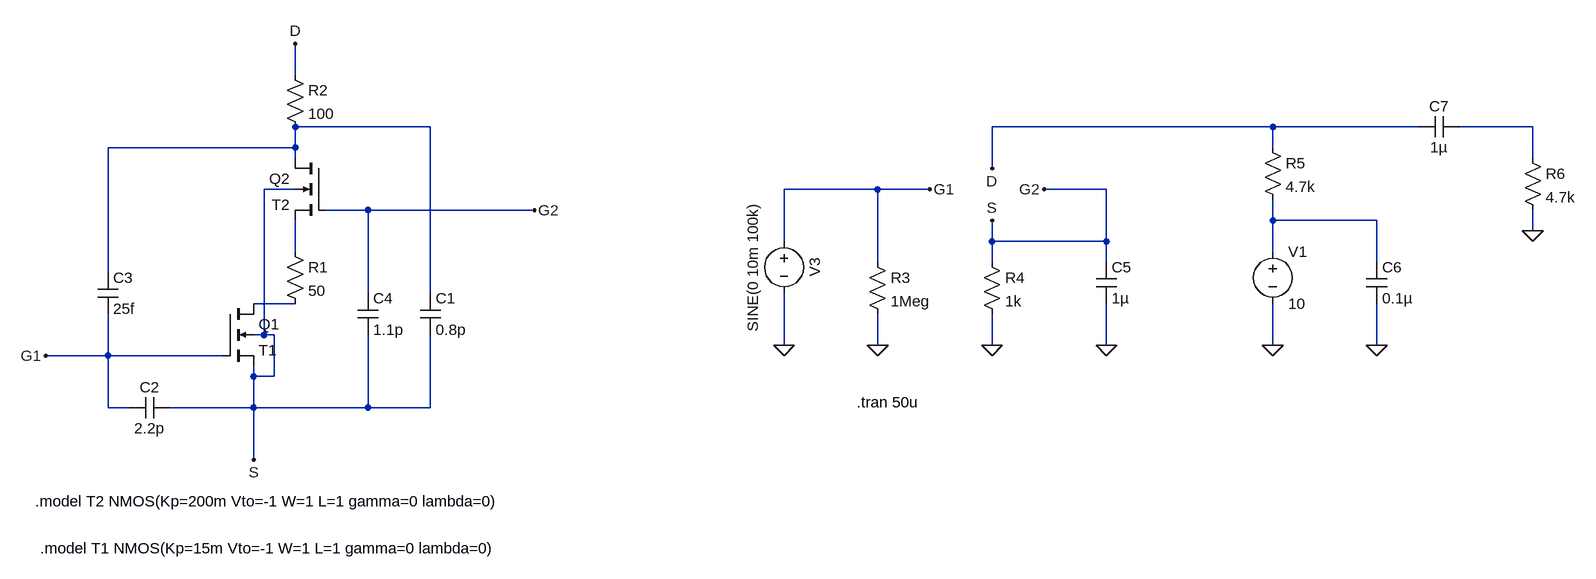
[diagram p0: schematic Ganancia_AV_Macromodelo.asc]
Ganancia_AV_Macromodelo.asc, the LTspice schematic file:
Version 4
SHEET 1 2140 680
WIRE 144 -256 144 -304
WIRE 352 -176 144 -176
WIRE 1648 -176 1216 -176
WIRE 1872 -176 1648 -176
WIRE 2048 -176 1936 -176
WIRE 144 -144 144 -176
WIRE 144 -144 -144 -144
WIRE 1648 -144 1648 -176
WIRE 144 -128 144 -144
WIRE 2048 -128 2048 -176
WIRE 1216 -112 1216 -176
WIRE 144 -80 96 -80
WIRE 1040 -80 896 -80
WIRE 1120 -80 1040 -80
WIRE 1392 -80 1296 -80
WIRE 256 -48 192 -48
WIRE 512 -48 256 -48
WIRE 1648 -32 1648 -64
WIRE 1808 -32 1648 -32
WIRE 2048 -16 2048 -48
WIRE 896 0 896 -80
WIRE 1216 0 1216 -32
WIRE 1392 0 1392 -80
WIRE 1392 0 1216 0
WIRE 144 16 144 -32
WIRE 1648 16 1648 -32
WIRE 1040 32 1040 -80
WIRE 1216 32 1216 0
WIRE 1392 32 1392 0
WIRE 1808 32 1808 -32
WIRE -144 48 -144 -144
WIRE 256 80 256 -48
WIRE 352 80 352 -176
WIRE 144 96 80 96
WIRE 96 144 96 -80
WIRE 96 144 80 144
WIRE 112 144 96 144
WIRE 896 160 896 80
WIRE 1040 160 1040 112
WIRE 1216 160 1216 112
WIRE 1392 160 1392 96
WIRE 1648 160 1648 96
WIRE 1808 160 1808 96
WIRE -144 176 -144 112
WIRE -144 176 -240 176
WIRE 32 176 -144 176
WIRE 80 208 80 192
WIRE 112 208 112 144
WIRE 112 208 80 208
WIRE -144 256 -144 176
WIRE -112 256 -144 256
WIRE 80 256 80 208
WIRE 80 256 -48 256
WIRE 256 256 256 144
WIRE 256 256 80 256
WIRE 352 256 352 144
WIRE 352 256 256 256
WIRE 80 336 80 256
FLAG 144 -304 D
FLAG -240 176 G1
FLAG 512 -48 G2
FLAG 80 336 S
FLAG 1040 160 0
FLAG 1216 160 0
FLAG 1392 160 0
FLAG 1216 -32 S
FLAG 1120 -80 G1
FLAG 1296 -80 G2
FLAG 1216 -112 D
FLAG 1648 160 0
FLAG 1808 160 0
FLAG 2048 -16 0
FLAG 896 160 0
DATAFLAG 1040 -80 ""
DATAFLAG 1392 -80 ""
DATAFLAG 1648 -176 ""
DATAFLAG 1216 -176 ""
DATAFLAG 1648 -32 ""
DATAFLAG 1216 0 ""
DATAFLAG 1808 -32 ""
DATAFLAG 2048 -176 ""
SYMBOL res 128 0 R0
SYMATTR InstName R1
SYMATTR Value 50
SYMBOL nmos4 192 -128 M0
SYMATTR InstName Q2
SYMATTR Value T2
SYMBOL cap 336 80 R0
SYMATTR InstName C1
SYMATTR Value 0.8p
SYMBOL cap -48 240 R90
WINDOW 0 0 32 VBottom 2
WINDOW 3 32 32 VTop 2
SYMATTR InstName C2
SYMATTR Value 2.2p
SYMBOL cap -160 48 R0
SYMATTR InstName C3
SYMATTR Value 25f
SYMBOL nmos4 32 96 R0
SYMATTR InstName Q1
SYMATTR Value T1
SYMBOL cap 240 80 R0
SYMATTR InstName C4
SYMATTR Value 1.1p
SYMBOL res 128 -272 R0
SYMATTR InstName R2
SYMATTR Value 100
SYMBOL res 1024 16 R0
SYMATTR InstName R3
SYMATTR Value 1Meg
SYMBOL res 1200 16 R0
SYMATTR InstName R4
SYMATTR Value 1k
SYMBOL cap 1376 32 R0
SYMATTR InstName C5
SYMATTR Value 1µ
SYMBOL res 1632 -160 R0
SYMATTR InstName R5
SYMATTR Value 4.7k
SYMBOL voltage 1648 0 R0
SYMATTR InstName V1
SYMATTR Value 10
SYMBOL cap 1792 32 R0
SYMATTR InstName C6
SYMATTR Value 0.1µ
SYMBOL cap 1936 -192 R90
WINDOW 0 0 32 VBottom 2
WINDOW 3 32 32 VTop 2
SYMATTR InstName C7
SYMATTR Value 1µ
SYMBOL res 2032 -144 R0
SYMATTR InstName R6
SYMATTR Value 4.7k
SYMBOL voltage 896 -16 R0
WINDOW 0 32 56 VTop 2
WINDOW 3 -32 56 VBottom 2
WINDOW 123 0 0 Left 0
WINDOW 39 0 0 Left 0
SYMATTR InstName V3
SYMATTR Value SINE(0 10m 100k)
TEXT -256 400 Left 2 !.model T2 NMOS(Kp=200m Vto=-1 W=1 L=1 gamma=0 lambda=0)
TEXT -248 472 Left 2 !.model T1 NMOS(Kp=15m Vto=-1 W=1 L=1 gamma=0 lambda=0)
TEXT 1008 248 Left 2 !.tran 50u

The netlist it stands for:
* Ganancia_AV_Macromodelo.asc
R1 N004 N005 50
M§Q2 N001 S N004 S T2
C1 N001 S 0.8p
C2 S G1 2.2p
C3 N001 G1 25f
M§Q1 N005 G1 S S T1
C4 S S 1.1p
R2 D N001 100
R3 G1 0 1Meg
R4 S 0 1k
C5 S 0 1µ
R5 D N003 4.7k
V1 N003 0 10
C6 N003 0 0.1µ
C7 N002 D 1µ
R6 N002 0 4.7k
V3 G1 0 SINE(0 10m 100k)
.model NMOS NMOS
.model PMOS PMOS
.lib standard.mos
.model T2 NMOS(Kp=200m Vto=-1 W=1 L=1 gamma=0 lambda=0)
.model T1 NMOS(Kp=15m Vto=-1 W=1 L=1 gamma=0 lambda=0)
.tran 50u
.backanno
.end